# EAGLE design lcd_display_board (EAGLE 7.7.0)
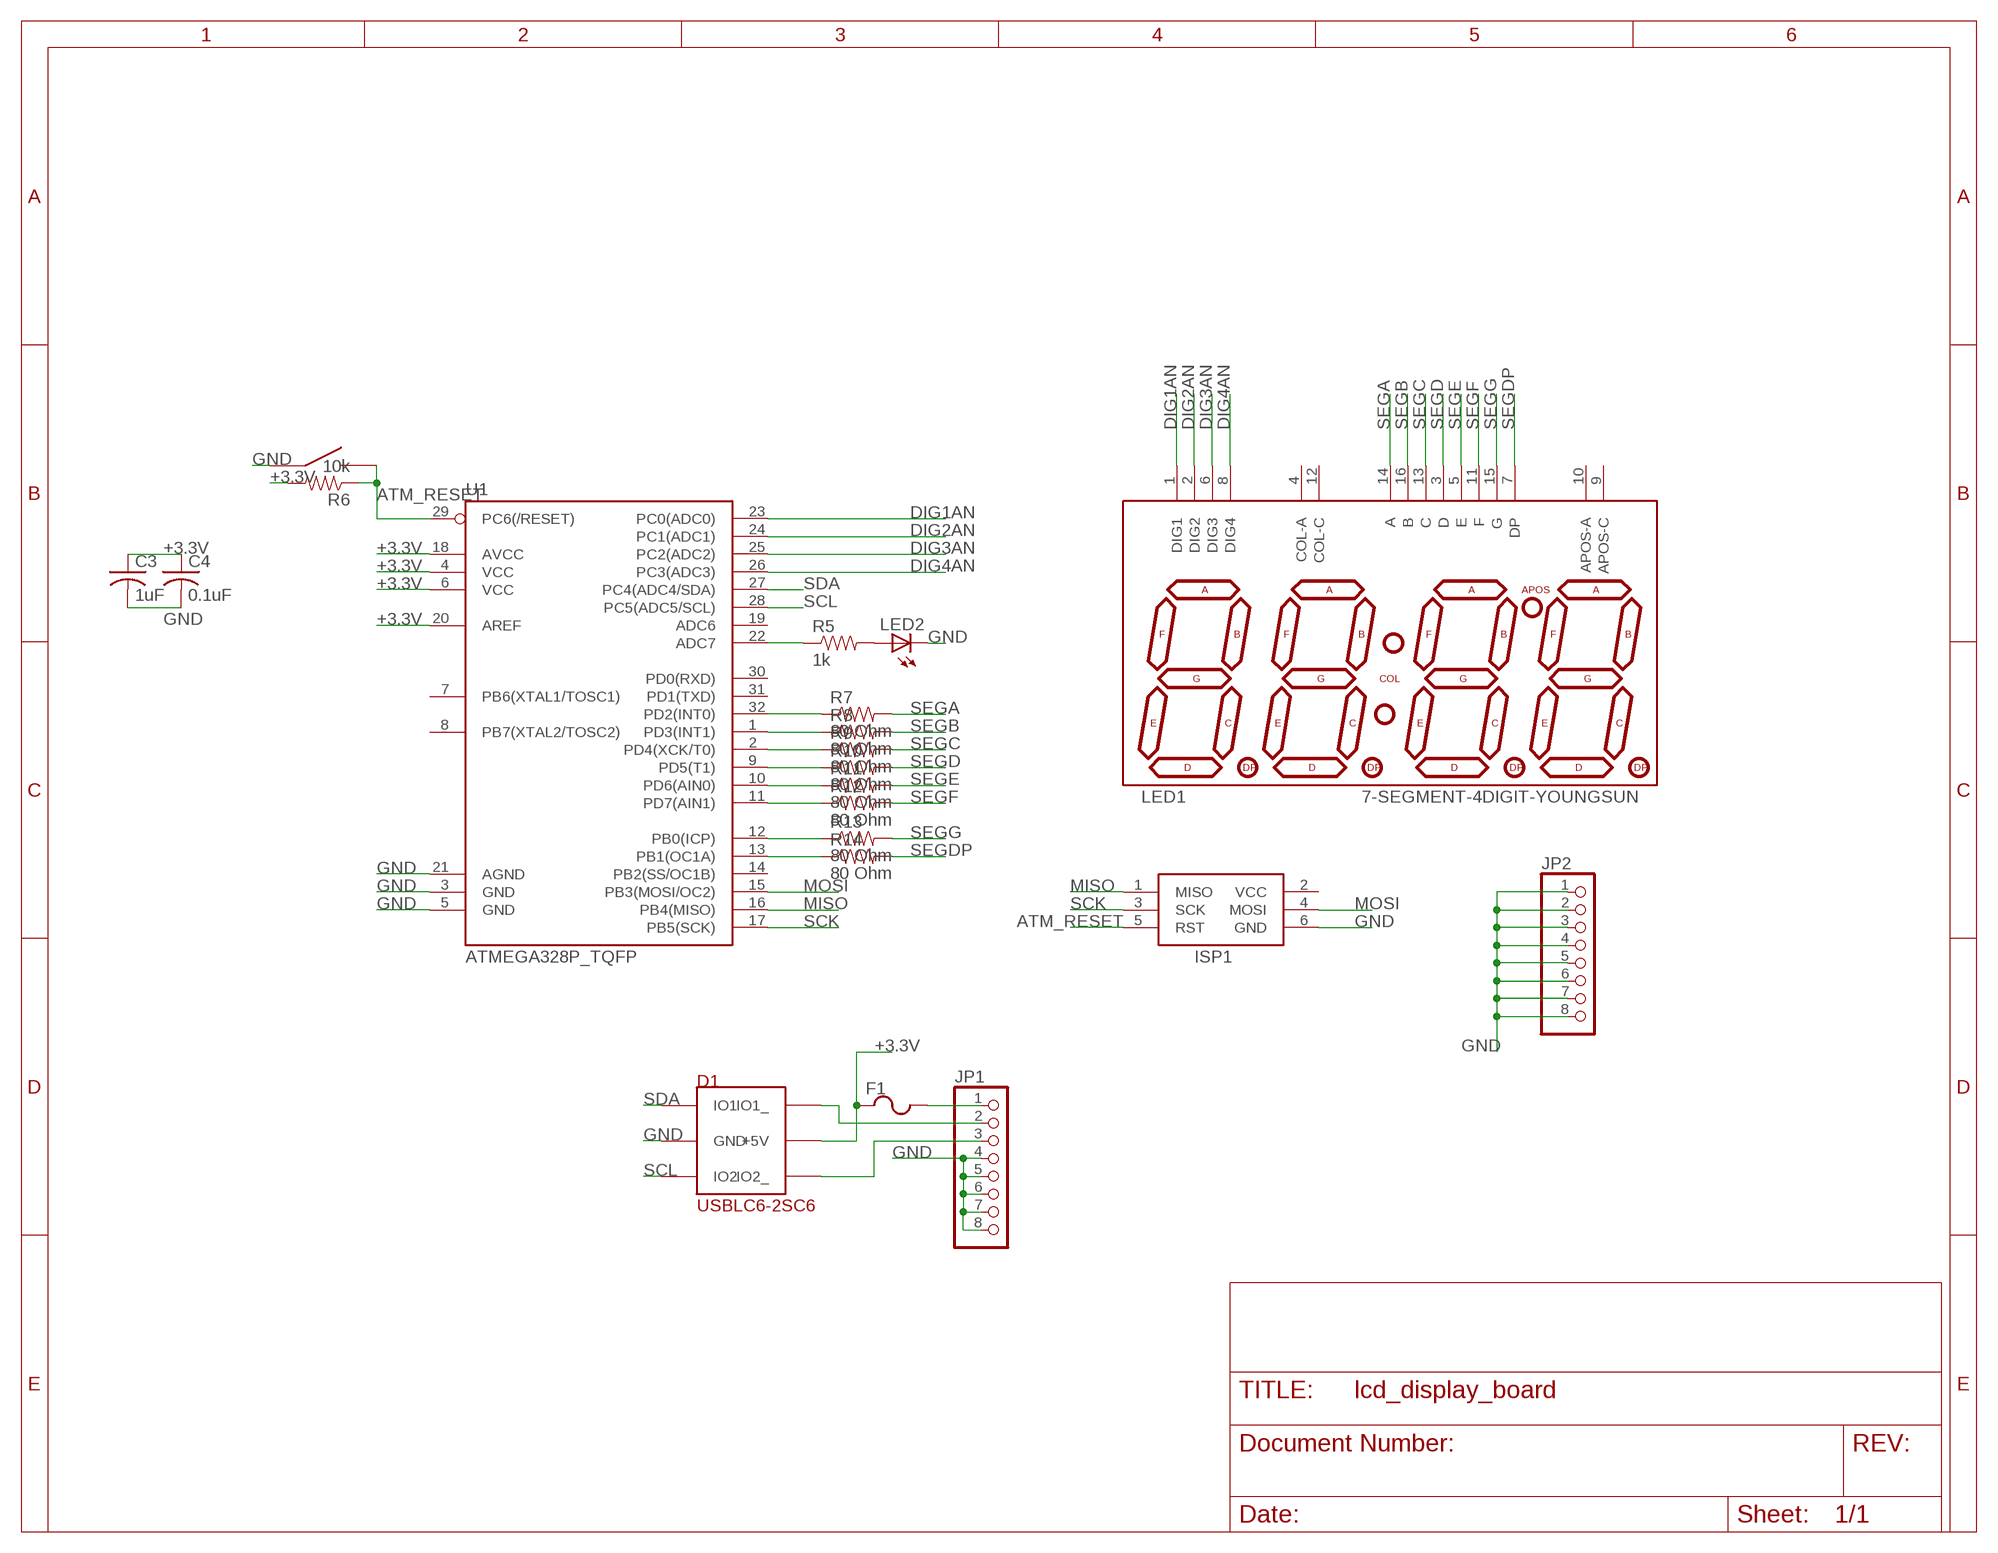
[diagram p0: schematic, sheet 1]

## Parts
C3  1uF  C-USC0805  [C0805]
C4  0.1uF  C-USC0805  [C0805]
D1  USBLC6-2SC6  [USBLC6-2SC6]
F1  POLYFUSE  [1206]
ISP1  AVRISP-BOX  [AVRISP-BOX]
JP1  PINHD-1X8BIG  [1X08-BIG]
JP2  PINHD-1X8BIG  [1X08-BIG]
LED1  7-SEGMENT-4DIGIT-YOUNGSUN  [7-SEGMENT-4DIGIT-YOUNGSUN]
LED2  LEDCHIPLED_0805  [CHIPLED_0805]
R5  1k  RESISTOR0603-RES  [0603-RES]
R6  10k  RESISTOR0603-RES  [0603-RES]
R7  80 Ohm  RESISTOR0603-RES  [0603-RES]
R8  80 Ohm  RESISTOR0603-RES  [0603-RES]
R9  80 Ohm  RESISTOR0603-RES  [0603-RES]
R10  80 Ohm  RESISTOR0603-RES  [0603-RES]
R11  80 Ohm  RESISTOR0603-RES  [0603-RES]
R12  80 Ohm  RESISTOR0603-RES  [0603-RES]
R13  80 Ohm  RESISTOR0603-RES  [0603-RES]
R14  80 Ohm  RESISTOR0603-RES  [0603-RES]
U1  ATMEGA328P_TQFP  [TQFP32-08]
U$10  EG4621CT-ND  [EG4621CT-ND]

## Nets
+3.3V: C3.1 C4.1 D1.P$5(+5V) F1.1 R6.2 U1.4(VCC) U1.6(VCC) U1.18(AVCC) U1.20(AREF)
ATM_RESET: ISP1.5(RST) R6.1 U1.29(PC6(/RESET)) U$10.P$3 U$10.P$4
DIG1AN: LED1.1(DIG1) U1.23(PC0(ADC0))
DIG2AN: LED1.2(DIG2) U1.24(PC1(ADC1))
DIG3AN: LED1.6(DIG3) U1.25(PC2(ADC2))
DIG4AN: LED1.8(DIG4) U1.26(PC3(ADC3))
GND: C3.2 C4.2 D1.P$2(GND) ISP1.6(GND) JP1.4 JP1.5 JP1.6 JP1.7 JP1.8 JP2.1 JP2.2 JP2.3 JP2.4 JP2.5 JP2.6 JP2.7 JP2.8 LED2.C U1.3(GND) U1.5(GND) U1.21(AGND) U$10.P$1 U$10.P$2
MISO: ISP1.1(MISO) U1.16(PB4(MISO))
MOSI: ISP1.4(MOSI) U1.15(PB3(MOSI/OC2))
N$3: F1.2 JP1.1
N$6: D1.P$6(IO1_) JP1.2
N$7: R5.1 U1.22(ADC7)
N$8: LED2.A R5.2
N$9: R7.1 U1.32(PD2(INT0))
N$10: R8.1 U1.1(PD3(INT1))
N$11: R9.1 U1.2(PD4(XCK/T0))
N$12: R10.1 U1.9(PD5(T1))
N$13: R11.1 U1.10(PD6(AIN0))
N$14: R12.1 U1.11(PD7(AIN1))
N$15: R13.1 U1.12(PB0(ICP))
N$16: R14.1 U1.13(PB1(OC1A))
N$17: D1.P$4(IO2_) JP1.3
SCK: ISP1.3(SCK) U1.17(PB5(SCK))
SCL: D1.P$3(IO2) U1.28(PC5(ADC5/SCL))
SDA: D1.P$1(IO1) U1.27(PC4(ADC4/SDA))
SEGA: LED1.14(A) R7.2
SEGB: LED1.16(B) R8.2
SEGC: LED1.13(C) R9.2
SEGD: LED1.3(D) R10.2
SEGDP: LED1.7(DP) R14.2
SEGE: LED1.5(E) R11.2
SEGF: LED1.11(F) R12.2
SEGG: LED1.15(G) R13.2
Unconnected: LED1.4(COL-A) LED1.9(APOS-C) LED1.10(APOS-A) LED1.12(COL-C) U1.7(PB6(XTAL1/TOSC1)) U1.8(PB7(XTAL2/TOSC2)) U1.14(PB2(SS/OC1B)) U1.19(ADC6) U1.30(PD0(RXD)) U1.31(PD1(TXD))

## Power pins joined to a net without a drawn wire
VCC: ISP1.2(VCC)

## Library data of the parts
C3 C4 = adafruit:C-US: CAPACITOR, American symbol
D1 = USBLC6-2SC6:USBLC6-2SC6: 5V TSV diode for protecting circuit board inputs. Also has Vcc Protection. Digikey 497-5235-6-ND
F1 = polyfuse:POLYFUSE: Resistor Basic schematic elements and footprints for 0603, 1206, and PTH resistors.
ISP1 = adafruit:AVRISP: AVR ISP HEADER Standard 6 pin header for AVR programming
JP1 JP2 = adafruit:PINHD-1X8: PIN HEADER
LED1 = SparkFun-Displays:7-SEGMENT-4DIGIT-YOUNGSUN: This is a part for the 4-Digit 7-segment LEDs from Young Sun. Different from the Digikey LEDs, all 16 pins are used. The LONGPADS Variant is used for a test jig, but you may like it because there is more pad to solder to. If you are concerned about routing space, the standard works just fine though.
LED2 = adafruit:LED: LED OSRAM: - CHIPLED LG R971, LG N971, LY N971, LG Q971, LY Q971, LO R971, LY R971 LH N974, LH R974 LS Q976, LO Q976, LY Q976 LO Q996 - Hyper CHIPLED LW Q18S LB Q993, LB Q99A, LB R99A - SideLED LS A670, LO A670, LY A670, LG A670, LP A670 LB A673, LV A673, LT A673, LW A673 LH A674 LY A675 LS A676, LA A676, LO A676, LY A676, LW A676 LS A679, LY A679, LG A679 - Hyper Micro SIDELED® LS Y876, LA Y876, LO Y876, LY Y876 LT Y87S - SmartLED LW L88C, LW L88S LB L89C, LB L89S, LG L890 LS L89K, LO L89K, LY L89K LS L896, LA L896, LO L896, LY L896 - TOPLED LS T670, LO T670, LY T670, LG T670, LP T670 LSG T670, LSP T670, LSY T670, LOP T670, LYG T670 LG T671, LOG T671, LSG T671 LB T673, LV T673, LT T673, LW T673 LH T674 LS T676, LA T676, LO T676, LY T676, LB T676, LH T676, LSB T676, LW T676 LB T67C, LV T67C, LT T67C, LS T67K, LO T67K, LY T67K, LW E67C LS E67B, LA E67B, LO E67B, LY E67B, LB E67C, LV E67C, LT E67C LW T67C LS T679, LY T679, LG T679 LS T770, LO T770, LY T770, LG T770, LP T770 LB T773, LV T773, LT T773, LW T773 LH T774 LS E675, LA E675, LY E675, LS T675 LS T776, LA T776, LO T776, LY T776, LB T776 LHGB T686 LT T68C, LB T68C - Hyper Mini TOPLED® LB M676 - Mini TOPLED Santana® LG M470 LS M47K, LO M47K, LY M47K Source: http://www.osram.convergy.de/
R5-R14 = SparkFun-Resistors:RESISTOR: Resistor Basic schematic elements and footprints for 0603, 1206, and PTH resistors.
U1 = SparkFun-DigitalIC:ATMEGA328P_TQFP; PROD_ID: IC-09069
U$10 = EG4621CT-ND:EG4621CT-ND: surface mount push putton digikey number EG4621CT-ND

## Board
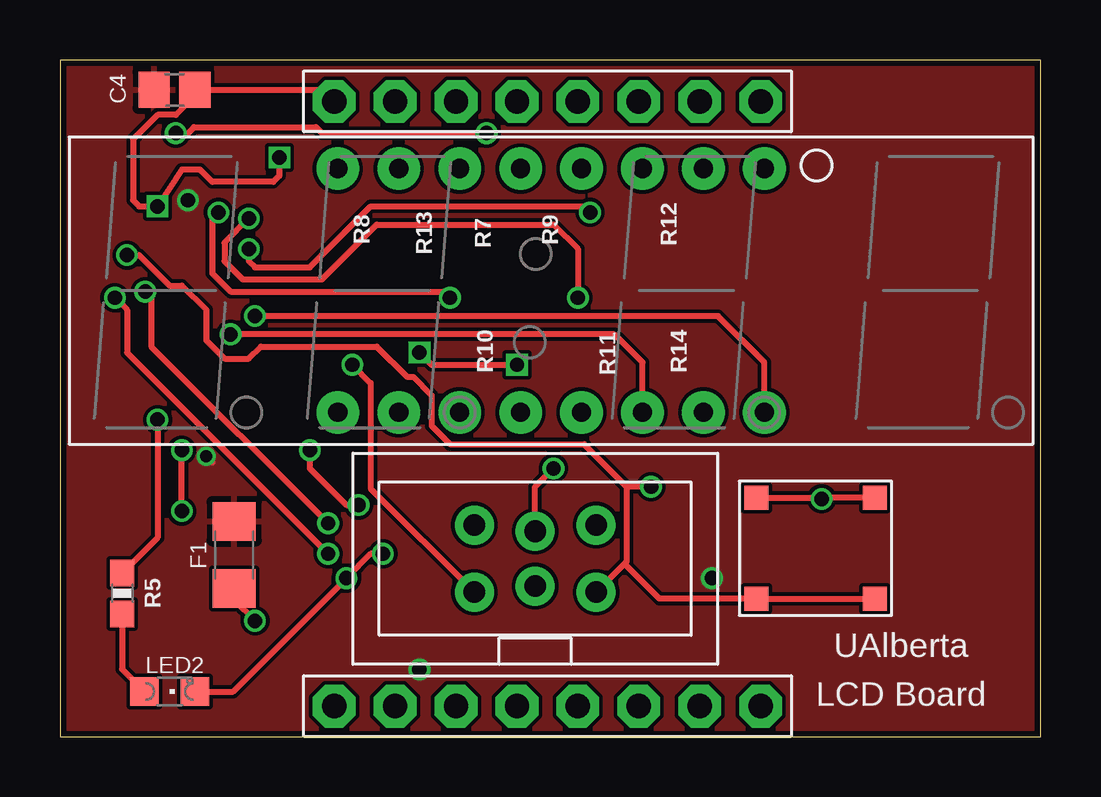
[diagram p1: board, top side]
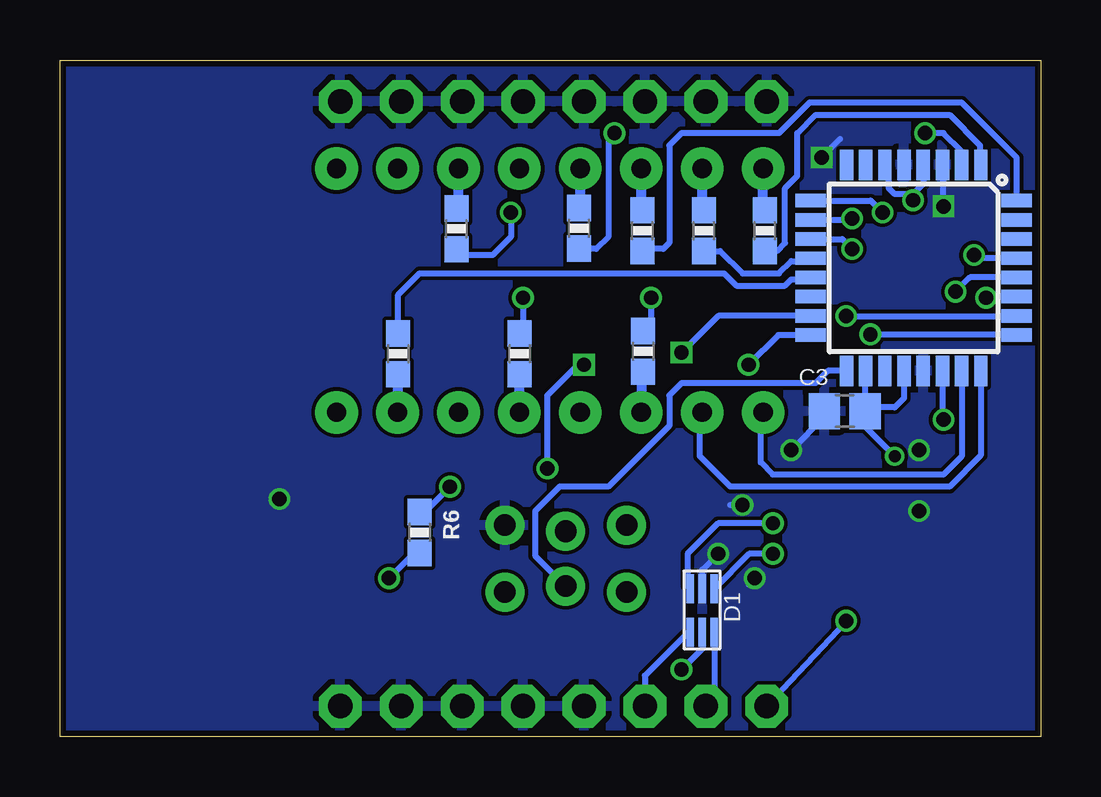
[diagram p2: board, bottom side, seen from below]

Size 40.89 x 28.19 mm. Coordinates in mm from the lower left corner, seen from the top.
Outline: 0,0 40.89,0 40.89,28.19 0,28.19 0,0
Copper layers (1*16): Top 0.035mm / dielectric 1.5mm / Bottom 0.035mm
Design rules "SeeedStudio_2layer_DRU_no_angle_20140221": minimum track width 6mil, minimum drill 12mil, track to track 6mil, track to pad 6mil, pad to pad 6mil, via to via 6mil, smd to smd 0mil, copper to edge 10mil, drill to drill 10mil, minimum pad ring 10mil, minimum via ring 6mil, stop-mask expansion 2mil, vias tented up to drill 100mil, thermal gap 10mil

### Footprints (pad centres in the part's own frame; a part is rotated, then mirrored left to right if it is on the bottom)
C0805 = smd 1.3 x 1.5: 1 -0.85,0; 2 0.85,0
USBLC6-2SC6 = smd 0.3 x 1.2: P$1 -0.5,-0.91; P$2 0,-0.91; P$3 0.5,-0.91; P$4 0.5,0.91; P$5 0,0.91; P$6 -0.5,0.91
1206 = smd 1.6 x 1.8: 1 -1.4,0; 2 1.4,0
AVRISP-BOX = drill 0.9 pad 1.626: 1 -1.397,2.54; 2 1.397,2.54; 3 -1.143,0; 4 1.143,0; 5 -1.397,-2.54; 6 1.397,-2.54
1X08-BIG = drill 1.016 pad 1.778 octagon: 1 -8.89,0; 2 -6.35,0; 3 -3.81,0; 4 -1.27,0; 5 1.27,0; 6 3.81,0; 7 6.35,0; 8 8.89,0
7-SEGMENT-4DIGIT-YOUNGSUN = drill 0.8 pad 1.778: 1 -8.89,-5.08; 2 -6.35,-5.08; 3 -3.81,-5.08; 4 -1.27,-5.08; 5 1.27,-5.08; 6 3.81,-5.08; 7 6.35,-5.08; 8 8.89,-5.08; 9 8.89,5.08; 10 6.35,5.08; 11 3.81,5.08; 12 1.27,5.08; 13 -1.27,5.08; 14 -3.81,5.08; 15 -6.35,5.08; 16 -8.89,5.08
CHIPLED_0805 = smd 1.2 x 1.2: A 0,-1.05; C 0,1.05
0603-RES = smd 1.1 x 1: 1 -0.85,0; 2 0.85,0
TQFP32-08 = smd 1.27 x 0.559: 1 -4.293,2.8; 2 -4.293,2; 3 -4.293,1.2; 4 -4.293,0.4; 5 -4.293,-0.4; 6 -4.293,-1.2; 7 -4.293,-2; 8 -4.293,-2.8; 17 4.293,-2.8; 18 4.293,-2; 19 4.293,-1.2; 20 4.293,-0.4; 21 4.293,0.4; 22 4.293,1.2; 23 4.293,2; 24 4.293,2.8 | smd 0.559 x 1.27: 9 -2.8,-4.293; 10 -2,-4.293; 11 -1.2,-4.293; 12 -0.4,-4.293; 13 0.4,-4.293; 14 1.2,-4.293; 15 2,-4.293; 16 2.8,-4.293; 25 2.8,4.293; 26 2,4.293; 27 1.2,4.293; 28 0.4,4.293; 29 -0.4,4.293; 30 -1.2,4.293; 31 -2,4.293; 32 -2.8,4.293
EG4621CT-ND = smd 1 x 1: P$1 -2.475,2.1; P$2 2.475,2.1; P$3 -2.475,-2.1; P$4 2.475,-2.1

### Placement (x,y rotation side)
C3  8.18,13.56 180 bottom
C4  4.78,26.95 0 top
D1  14.12,5.26 180 bottom
F1  7.26,7.57 270 top
ISP1  19.81,7.42 90 top
JP1  20.32,1.27 0 top
JP2  20.32,26.47 180 top
LED1  20.47,18.59 0 top
LED2  4.57,1.88 270 top
R5  2.59,5.97 270 top
R6  25.91,8.51 270 bottom
R7  16.61,21.08 90 bottom
R8  11.51,21.08 90 bottom
R9  19.25,21.18 90 bottom
R10  16.59,16.05 270 bottom
R11  21.74,15.95 270 bottom
R12  24.36,21.16 90 bottom
R13  14.05,21.08 90 bottom
R14  26.8,15.95 270 bottom
U1  5.31,19.53 270 bottom
U$10  31.5,7.85 0 top

### Tracks (layer width: path | path; a pad name or v marks a point on that pad's centre or on a via)
+3.3V  (via drill 0.5, 0.6)
  Top 0.254: v27.18,6.6 27.18,6.35 | v14.99,2.79 14.73,3.05 | v6.1,11.68 6.35,11.43
  Bottom 0.254: U1.4 4.91,23.03 5.33,22.61 5.59,22.61 | 5.59,22.61 6.1,22.61 6.35,22.86 6.35,23.67 U1.6 | R6.2 26.12,7.66 v27.18,6.6 | D1.P$5 14.12,3.66 v14.99,2.79 | C3.1 7.33,15.22 U1.18 | U1.20 5.71,14.1 6.1,13.72 7.18,13.72 C3.1 | C3.1 7.33,12.92 v6.1,11.68 | v5.33,22.35 5.59,22.61
  pour Top: -1.27,-1.27 41.91,-1.27 41.91,30.23 -1.27,30.23
ATM_RESET  (via drill 0.6)
  Top 0.254: v2.79,20.07 3.3,20.07 4.57,18.8 5.08,18.8 6.1,17.78 6.1,16.51 6.86,15.75 7.87,15.75 8.38,16.26 13.21,16.26 14.48,14.99 14.73,14.99 15.49,14.22 15.49,12.95 16.26,12.19 21.84,12.19 23.62,10.41 | 23.62,10.41 23.62,7.29 23.53,7.2 | 23.53,7.2 ISP1.5 | 23.53,7.2 24.98,5.75 U$10.P$3 U$10.P$4 | v24.64,10.41 23.62,10.41
  Bottom 0.254: U1.29 2.67,19.93 v2.79,20.07 | R6.1 25.69,9.36 v24.64,10.41
DIG1AN
  Bottom 0.254: U1.23 3.31,11.68 4.06,10.92 11.18,10.92 11.68,11.43 11.68,13.41 LED1.1
DIG2AN
  Bottom 0.254: U1.24 2.51,11.71 3.81,10.41 12.95,10.41 14.22,11.68 14.22,13.41 LED1.2
DIG3AN  (via drill 0.6)
  Top 0.254: LED1.6 24.28,15.6 23.11,16.76 v7.11,16.76
  Bottom 0.254: v7.11,16.76 1.05,16.76 U1.25
DIG4AN  (via drill 0.6)
  Top 0.254: LED1.8 29.36,15.6 27.43,17.53 v8.13,17.53
  Bottom 0.254: v8.13,17.53 U1.26
GND  (via drill 0.6)
  Top 0.254: U$10.P$2 31.79,9.95 v31.75,9.91 31.71,9.95 U$10.P$1 | v13.46,7.62 12.95,7.62 v11.94,6.6 7.21,1.88 LED2.C | v5.08,9.4 v5.08,11.94 | v10.41,11.94 10.41,11.18 11.94,9.65 v12.45,9.65 | JP2.8 10.95,26.95 C4.2 5.62,26.71 4.83,25.91 4.06,25.91 3.05,24.89 3.05,22.35 3.3,22.1 v4.06,22.1 5.08,23.62 5.84,23.62 6.35,23.11 8.89,23.11 9.14,23.37 v9.14,24.13
  Bottom 0.254: v31.75,9.91 31.75,10.16 | D1.P$2 14.12,6.96 v13.46,7.62 | v11.94,6.6 12.19,6.35 | C3.2 9.03,13.32 v10.41,11.94 | v12.45,9.65 12.95,9.65 | 8.38,24.89 v9.14,24.13 | v4.06,22.1 4.06,23.78 U1.3
  pour Bottom: -1.98,42.52 52.58,42.52 52.58,-1.98 -2.13,-1.98 -2.13,42.52
MISO  (via drill 0.6)
  Top 0.254: v12.19,15.49 12.95,14.73 12.95,10.34 ISP1.1
  Bottom 0.254: U1.16 10.95,16.73 v12.19,15.49
MOSI  (via drill 0.6)
  Top 0.254: v14.99,16 15.49,15.49 v19.05,15.49 | ISP1.4 19.81,10.41 v20.57,11.18
  Bottom 0.254: U1.15 13.46,17.53 v14.99,16 | v19.05,15.49 19.3,15.49 20.32,14.48 20.57,14.22 v20.57,11.18
N$3  (via drill 0.6)
  Top 0.254: F1.2 7.26,5.69 v8.13,4.83
  Bottom 0.254: v8.13,4.83 8.13,4.78 JP1.1
N$6
  Bottom 0.254: D1.P$6 13.62,1.82 JP1.2
N$7  (via drill 0.6)
  Top 0.254: v4.06,13.21 4.06,8.29 R5.1
  Bottom 0.254: U1.22 4.11,13.25 v4.06,13.21
N$8
  Top 0.254: R5.2 2.59,2.81 LED2.A
N$9
  Bottom 0.254: U1.32 1.02,24.13 3.3,26.42 9.65,26.42 10.92,25.15 14.99,25.15 15.49,24.64 15.49,20.57 15.75,20.32 16.52,20.32 R7.1
N$10
  Bottom 0.254: R8.1 11.01,20.23 10.67,20.57 10.67,22.86 10.16,23.37 10.16,25.15 9.4,25.91 3.81,25.91 2.54,24.64 2.54,23.86 U1.1
N$11  (via drill 0.6)
  Top 0.254: v4.83,25.15 5.33,25.15 5.59,25.4 10.67,25.4 10.92,25.15 v17.78,25.15
  Bottom 0.254: U1.2 3.31,24.39 4.06,25.15 v4.83,25.15 | v17.78,25.15 18.03,24.89 18.03,20.83 18.54,20.32 R9.1
N$12  (via drill 0.6)
  Top 0.254: v6.6,21.84 6.35,21.59 6.35,19.3 7.11,18.54 16,18.54 v16.26,18.29
  Bottom 0.254: U1.9 7.09,22.33 v6.6,21.84 | v16.26,18.29 16.26,17.23 R10.1
N$13  (via drill 0.6)
  Top 0.254: v7.87,21.59 6.86,20.57 6.86,19.81 7.62,19.05 10.92,19.05 13.21,21.34 20.57,21.34 21.59,20.32 v21.59,18.29
  Bottom 0.254: U1.10 7.93,21.53 v7.87,21.59 | v21.59,18.29 21.59,16.95 R11.1
N$14  (via drill 0.6)
  Top 0.254: v7.87,20.32 7.87,19.81 8.13,19.56 10.41,19.56 12.95,22.1 21.84,22.1 v22.1,21.84
  Bottom 0.254: U1.11 8.29,20.73 v7.87,20.32 | v22.1,21.84 22.1,20.83 22.86,20.07 24.12,20.07 R12.1
N$15
  Bottom 0.254: R13.1 13.37,20.23 12.45,19.3 10.92,19.3 10.41,19.81 9.72,19.81 U1.12
N$16
  Bottom 0.254: R14.1 26.8,18.41 25.91,19.3 13.21,19.3 12.7,18.8 10.67,18.8 10.41,19.05 9.68,19.05 U1.13
N$17
  Bottom 0.254: D1.P$4 14.7,4.35 16.51,2.54 JP1.3
SCK
  Bottom 0.254: ISP1.3 21.08,7.54 21.08,9.4 20.07,10.41 18.03,10.41 15.49,12.95 15.49,14.22 14.99,14.73 9.4,14.73 8.89,15.24 U1.17
SCL  (via drill 0.6)
  Top 0.254: v3.56,18.54 3.81,18.29 3.81,16.26 v11.18,8.89
  Bottom 0.254: U1.28 2.96,19.13 v3.56,18.54 | v11.18,8.89 13.46,8.89 14.73,7.62 14.73,6.28 D1.P$3
SDA  (via drill 0.6)
  Top 0.254: v2.29,18.29 2.79,17.78 2.79,16 v11.18,7.62
  Bottom 0.254: U1.27 2.24,18.33 v2.29,18.29 | v11.18,7.62 12.17,7.62 D1.P$1
SEGA
  Bottom 0.406: R7.2 16.66,21.93 LED1.14
SEGB
  Bottom 0.406: R8.2 11.58,21.93 LED1.16
SEGC
  Bottom 0.406: R9.2 19.2,22.03 LED1.13
SEGD
  Bottom 0.406: R10.2 16.66,15.2 LED1.3
SEGDP
  Bottom 0.406: LED1.7 26.8,13.51 R14.2
SEGE
  Bottom 0.406: LED1.5 R11.2
SEGF
  Bottom 0.406: R12.2 24.28,22.01 LED1.11
SEGG
  Bottom 0.406: R13.2 14.12,21.93 LED1.15

### Text on the board
tPlace: UAlberta | LCD Board